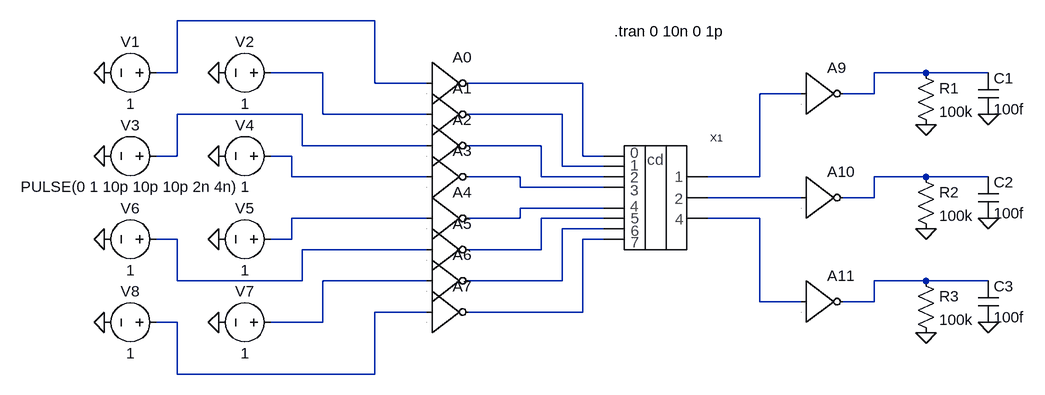
[diagram p0: schematic example_shifrator.asc]
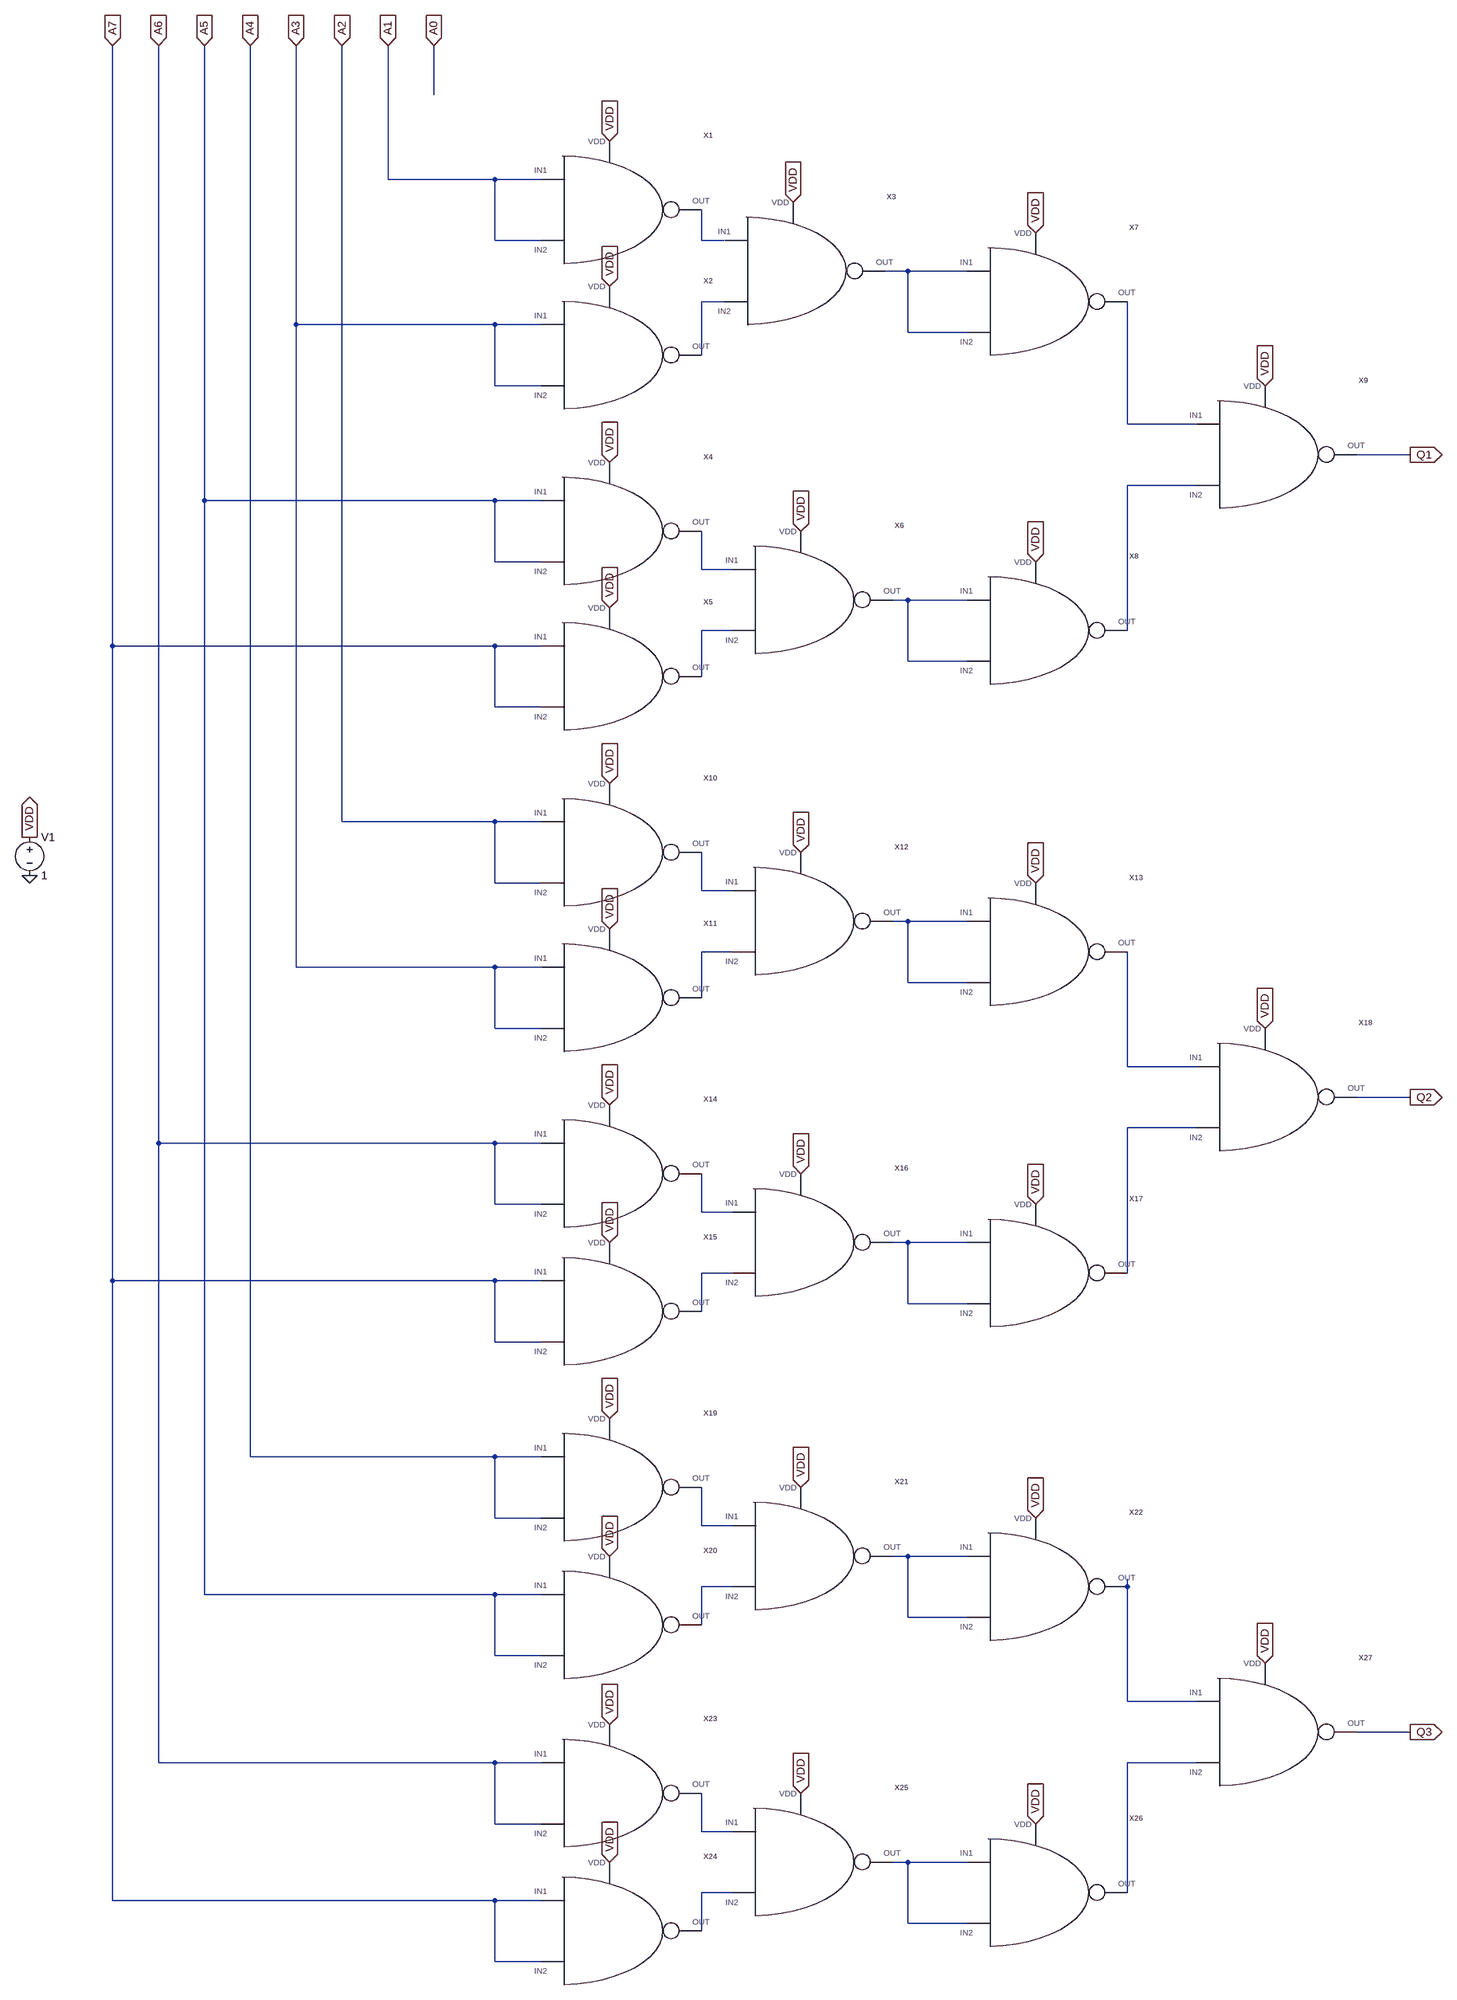
[diagram p1: sub-circuit shifrator.asc]
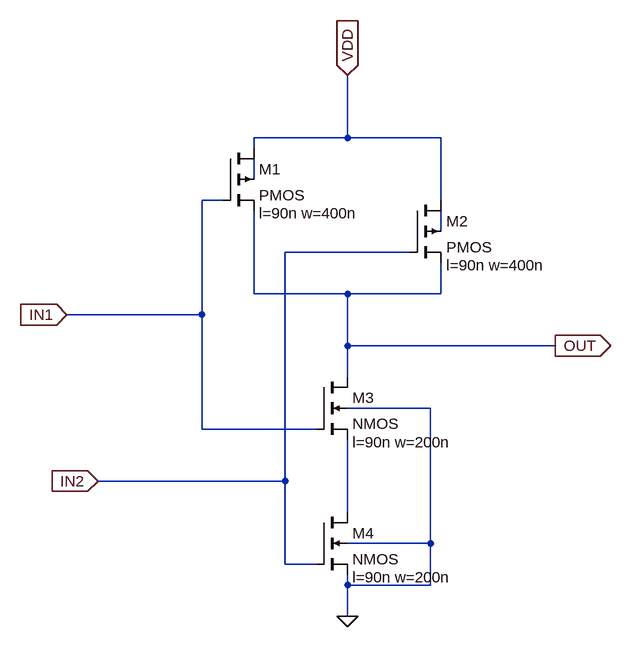
[diagram p2: sub-circuit nand.asc]
example_shifrator.asc, the LTspice schematic file:
Version 4
SHEET 1 1116 912
WIRE -192 -112 -496 -112
WIRE -496 -32 -496 -112
WIRE -496 -32 -528 -32
WIRE -272 -32 -352 -32
WIRE 656 -32 576 -32
WIRE 752 -32 656 -32
WIRE -192 -16 -192 -112
WIRE -112 -16 -192 -16
WIRE 128 -16 -48 -16
WIRE 464 0 400 0
WIRE 576 0 576 -32
WIRE 576 0 528 0
WIRE -304 32 -496 32
WIRE -272 32 -272 -32
WIRE -112 32 -272 32
WIRE 96 32 -48 32
WIRE -304 80 -304 32
WIRE -112 80 -304 80
WIRE 64 80 -48 80
WIRE -496 96 -496 32
WIRE -496 96 -528 96
WIRE -320 96 -352 96
WIRE 128 96 128 -16
WIRE 160 96 128 96
WIRE 96 112 96 32
WIRE 160 112 96 112
WIRE -320 128 -320 96
WIRE -112 128 -320 128
WIRE 32 128 -48 128
WIRE 64 128 64 80
WIRE 160 128 64 128
WIRE 400 128 400 0
WIRE 400 128 320 128
WIRE 656 128 576 128
WIRE 752 128 656 128
WIRE 32 144 32 128
WIRE 160 144 32 144
WIRE 464 160 320 160
WIRE 576 160 576 128
WIRE 576 160 528 160
WIRE 160 176 32 176
WIRE -112 192 -320 192
WIRE 32 192 32 176
WIRE 32 192 -48 192
WIRE 160 192 64 192
WIRE 400 192 320 192
WIRE 160 208 96 208
WIRE -496 224 -528 224
WIRE -320 224 -320 192
WIRE -320 224 -352 224
WIRE 160 224 128 224
WIRE -112 240 -304 240
WIRE 64 240 64 192
WIRE 64 240 -48 240
WIRE -496 288 -496 224
WIRE -304 288 -304 240
WIRE -304 288 -496 288
WIRE -112 288 -272 288
WIRE 96 288 96 208
WIRE 96 288 -48 288
WIRE 656 288 576 288
WIRE 752 288 656 288
WIRE 400 320 400 192
WIRE 464 320 400 320
WIRE 576 320 576 288
WIRE 576 320 528 320
WIRE -112 336 -192 336
WIRE 128 336 128 224
WIRE 128 336 -48 336
WIRE -496 352 -528 352
WIRE -272 352 -272 288
WIRE -272 352 -352 352
WIRE -496 432 -496 352
WIRE -192 432 -192 336
WIRE -192 432 -496 432
FLAG 656 48 0
FLAG 752 32 0
FLAG 656 208 0
FLAG 752 192 0
FLAG 656 368 0
FLAG 752 352 0
FLAG -608 -32 0
FLAG -432 -32 0
FLAG -608 96 0
FLAG -432 96 0
FLAG -432 224 0
FLAG -608 224 0
FLAG -432 352 0
FLAG -608 352 0
SYMBOL Digital\\inv -112 -80 R0
SYMATTR InstName A0
SYMBOL Digital\\inv -112 -32 R0
SYMATTR InstName A1
SYMBOL Digital\\inv -112 16 R0
SYMATTR InstName A2
SYMBOL Digital\\inv -112 64 R0
SYMATTR InstName A3
SYMBOL Digital\\inv -112 128 R0
SYMATTR InstName A4
SYMBOL Digital\\inv -112 176 R0
SYMATTR InstName A5
SYMBOL Digital\\inv -112 224 R0
SYMATTR InstName A6
SYMBOL Digital\\inv -112 272 R0
SYMATTR InstName A7
SYMBOL Digital\\inv 464 -64 R0
SYMATTR InstName A9
SYMBOL Digital\\inv 464 96 R0
SYMATTR InstName A10
SYMBOL Digital\\inv 464 256 R0
SYMATTR InstName A11
SYMBOL res 640 -48 R0
SYMATTR InstName R1
SYMATTR Value 100k
SYMBOL res 640 112 R0
SYMATTR InstName R2
SYMATTR Value 100k
SYMBOL res 640 272 R0
SYMATTR InstName R3
SYMATTR Value 100k
SYMBOL cap 736 -32 R0
SYMATTR InstName C1
SYMATTR Value 100f
SYMBOL cap 736 128 R0
SYMATTR InstName C2
SYMATTR Value 100f
SYMBOL cap 736 288 R0
SYMATTR InstName C3
SYMATTR Value 100f
SYMBOL voltage -512 -32 R90
WINDOW 0 -32 56 VBottom 2
WINDOW 3 32 56 VTop 2
WINDOW 123 0 0 Left 2
WINDOW 39 0 0 Left 2
SYMATTR InstName V1
SYMATTR Value 1
SYMBOL voltage -336 -32 R90
WINDOW 0 -32 56 VBottom 2
WINDOW 3 32 56 VTop 2
WINDOW 123 0 0 Left 2
WINDOW 39 0 0 Left 2
SYMATTR InstName V2
SYMATTR Value 1
SYMBOL voltage -512 96 R90
WINDOW 0 -32 56 VBottom 2
WINDOW 3 32 56 VTop 2
WINDOW 123 0 0 Left 2
WINDOW 39 0 0 Left 2
SYMATTR InstName V3
SYMATTR Value PULSE(0 1 10p 10p 10p 2n 4n)
SYMBOL voltage -336 96 R90
WINDOW 0 -32 56 VBottom 2
WINDOW 3 32 56 VTop 2
WINDOW 123 0 0 Left 2
WINDOW 39 0 0 Left 2
SYMATTR InstName V4
SYMATTR Value 1
SYMBOL voltage -336 224 R90
WINDOW 0 -32 56 VBottom 2
WINDOW 3 32 56 VTop 2
WINDOW 123 0 0 Left 2
WINDOW 39 0 0 Left 2
SYMATTR InstName V5
SYMATTR Value 1
SYMBOL voltage -512 224 R90
WINDOW 0 -32 56 VBottom 2
WINDOW 3 32 56 VTop 2
WINDOW 123 0 0 Left 2
WINDOW 39 0 0 Left 2
SYMATTR InstName V6
SYMATTR Value 1
SYMBOL voltage -336 352 R90
WINDOW 0 -32 56 VBottom 2
WINDOW 3 32 56 VTop 2
WINDOW 123 0 0 Left 2
WINDOW 39 0 0 Left 2
SYMATTR InstName V7
SYMATTR Value 1
SYMBOL voltage -512 352 R90
WINDOW 0 -32 56 VBottom 2
WINDOW 3 32 56 VTop 2
WINDOW 123 0 0 Left 2
WINDOW 39 0 0 Left 2
SYMATTR InstName V8
SYMATTR Value 1
SYMBOL shifrator 240 160 R0
SYMATTR InstName X1
TEXT 176 -96 Left 2 !.tran 0 10n 0 1p

shifrator.asc, the sub-circuit schematic file:
Version 4
SHEET 1 1628 3896
WIRE -512 -112 -512 -256
WIRE -608 64 -608 -256
WIRE -384 64 -608 64
WIRE -288 64 -384 64
WIRE -384 192 -384 64
WIRE -288 192 -384 192
WIRE 48 192 48 128
WIRE 96 192 48 192
WIRE 480 256 432 256
WIRE 608 256 480 256
WIRE 96 320 48 320
WIRE -800 368 -800 -256
WIRE -384 368 -800 368
WIRE -288 368 -384 368
WIRE 480 384 480 256
WIRE 608 384 480 384
WIRE 48 432 48 320
WIRE -384 496 -384 368
WIRE -288 496 -384 496
WIRE 944 576 944 320
WIRE 1088 576 944 576
WIRE 1536 640 1424 640
WIRE 1088 704 944 704
WIRE -992 736 -992 -256
WIRE -384 736 -992 736
WIRE -288 736 -384 736
WIRE -384 864 -384 736
WIRE -288 864 -384 864
WIRE 48 880 48 800
WIRE 112 880 48 880
WIRE 480 944 448 944
WIRE 608 944 480 944
WIRE 112 1008 48 1008
WIRE 944 1008 944 704
WIRE -1184 1040 -1184 -256
WIRE -384 1040 -1184 1040
WIRE -288 1040 -384 1040
WIRE 480 1072 480 944
WIRE 608 1072 480 1072
WIRE 48 1104 48 1008
WIRE -384 1168 -384 1040
WIRE -288 1168 -384 1168
WIRE -704 1408 -704 -256
WIRE -384 1408 -704 1408
WIRE -288 1408 -384 1408
WIRE -384 1536 -384 1408
WIRE -288 1536 -384 1536
WIRE 48 1552 48 1472
WIRE 112 1552 48 1552
WIRE 480 1616 448 1616
WIRE 608 1616 480 1616
WIRE 112 1680 48 1680
WIRE -800 1712 -800 368
WIRE -384 1712 -800 1712
WIRE -288 1712 -384 1712
WIRE 480 1744 480 1616
WIRE 608 1744 480 1744
WIRE 48 1776 48 1680
WIRE -384 1840 -384 1712
WIRE -288 1840 -384 1840
WIRE 944 1920 944 1680
WIRE 1088 1920 944 1920
WIRE 1536 1984 1424 1984
WIRE 1088 2048 944 2048
WIRE -1088 2080 -1088 -256
WIRE -384 2080 -1088 2080
WIRE -288 2080 -384 2080
WIRE -384 2208 -384 2080
WIRE -288 2208 -384 2208
WIRE 48 2224 48 2144
WIRE 112 2224 48 2224
WIRE 480 2288 448 2288
WIRE 608 2288 480 2288
WIRE 112 2352 48 2352
WIRE 944 2352 944 2048
WIRE -1184 2368 -1184 1040
WIRE -384 2368 -1184 2368
WIRE -288 2368 -384 2368
WIRE 480 2416 480 2288
WIRE 608 2416 480 2416
WIRE 48 2432 48 2352
WIRE -384 2496 -384 2368
WIRE -288 2496 -384 2496
WIRE -896 2736 -896 -256
WIRE -384 2736 -896 2736
WIRE -288 2736 -384 2736
WIRE -384 2864 -384 2736
WIRE -288 2864 -384 2864
WIRE 48 2880 48 2800
WIRE 112 2880 48 2880
WIRE 480 2944 448 2944
WIRE 608 2944 480 2944
WIRE 112 3008 48 3008
WIRE 944 3008 944 2992
WIRE -992 3024 -992 736
WIRE -384 3024 -992 3024
WIRE -288 3024 -384 3024
WIRE 480 3072 480 2944
WIRE 608 3072 480 3072
WIRE 48 3088 48 3008
WIRE -384 3152 -384 3024
WIRE -288 3152 -384 3152
WIRE 944 3248 944 3008
WIRE 1088 3248 944 3248
WIRE 1536 3312 1424 3312
WIRE -1088 3376 -1088 2080
WIRE -384 3376 -1088 3376
WIRE -288 3376 -384 3376
WIRE 1088 3376 944 3376
WIRE -384 3504 -384 3376
WIRE -288 3504 -384 3504
WIRE 48 3520 48 3440
WIRE 112 3520 48 3520
WIRE 480 3584 448 3584
WIRE 608 3584 480 3584
WIRE 112 3648 48 3648
WIRE 944 3648 944 3376
WIRE -1184 3664 -1184 2368
WIRE -384 3664 -1184 3664
WIRE -288 3664 -384 3664
WIRE 480 3712 480 3584
WIRE 608 3712 480 3712
WIRE 48 3728 48 3648
WIRE -384 3792 -384 3664
WIRE -288 3792 -384 3792
FLAG -1184 -256 A7
IOPIN -1184 -256 In
FLAG -1088 -256 A6
IOPIN -1088 -256 In
FLAG -992 -256 A5
IOPIN -992 -256 In
FLAG -896 -256 A4
IOPIN -896 -256 In
FLAG -800 -256 A3
IOPIN -800 -256 In
FLAG -704 -256 A2
IOPIN -704 -256 In
FLAG -608 -256 A1
IOPIN -608 -256 In
FLAG -512 -256 A0
IOPIN -512 -256 In
FLAG 1536 640 Q1
IOPIN 1536 640 Out
FLAG 1536 1984 Q2
IOPIN 1536 1984 Out
FLAG 1536 3312 Q3
IOPIN 1536 3312 Out
FLAG -1776 1440 VDD
IOPIN -1776 1440 Out
FLAG -1776 1520 0
FLAG -144 1328 VDD
IOPIN -144 1328 In
FLAG -144 1632 VDD
IOPIN -144 1632 In
FLAG 256 1472 VDD
IOPIN 256 1472 In
FLAG -144 960 VDD
IOPIN -144 960 In
FLAG -144 -16 VDD
IOPIN -144 -16 In
FLAG 240 112 VDD
IOPIN 240 112 In
FLAG 752 176 VDD
IOPIN 752 176 In
FLAG -144 288 VDD
IOPIN -144 288 In
FLAG 1232 496 VDD
IOPIN 1232 496 In
FLAG -144 656 VDD
IOPIN -144 656 In
FLAG 256 800 VDD
IOPIN 256 800 In
FLAG 752 864 VDD
IOPIN 752 864 In
FLAG 752 1536 VDD
IOPIN 752 1536 In
FLAG 1232 1840 VDD
IOPIN 1232 1840 In
FLAG -144 2000 VDD
IOPIN -144 2000 In
FLAG 256 2144 VDD
IOPIN 256 2144 In
FLAG 752 2208 VDD
IOPIN 752 2208 In
FLAG -144 2288 VDD
IOPIN -144 2288 In
FLAG -144 2656 VDD
IOPIN -144 2656 In
FLAG 256 2800 VDD
IOPIN 256 2800 In
FLAG 752 2864 VDD
IOPIN 752 2864 In
FLAG -144 2944 VDD
IOPIN -144 2944 In
FLAG 1232 3168 VDD
IOPIN 1232 3168 In
FLAG -144 3296 VDD
IOPIN -144 3296 In
FLAG 256 3440 VDD
IOPIN 256 3440 In
FLAG 752 3504 VDD
IOPIN 752 3504 In
FLAG -144 3584 VDD
IOPIN -144 3584 In
SYMBOL nand -240 128 R0
SYMATTR InstName X1
SYMBOL nand -240 432 R0
SYMATTR InstName X2
SYMBOL nand 144 256 R0
SYMATTR InstName X3
SYMBOL nand -240 800 R0
SYMATTR InstName X4
SYMBOL nand -240 1104 R0
SYMATTR InstName X5
SYMBOL nand 160 944 R0
SYMATTR InstName X6
SYMBOL nand 656 320 R0
SYMATTR InstName X7
SYMBOL nand 656 1008 R0
SYMATTR InstName X8
SYMBOL nand 1136 640 R0
SYMATTR InstName X9
SYMBOL nand -240 1472 R0
SYMATTR InstName X10
SYMBOL nand -240 1776 R0
SYMATTR InstName X11
SYMBOL nand 160 1616 R0
SYMATTR InstName X12
SYMBOL nand 656 1680 R0
SYMATTR InstName X13
SYMBOL nand -240 2144 R0
SYMATTR InstName X14
SYMBOL nand -240 2432 R0
SYMATTR InstName X15
SYMBOL nand 160 2288 R0
SYMATTR InstName X16
SYMBOL nand 656 2352 R0
SYMATTR InstName X17
SYMBOL nand 1136 1984 R0
SYMATTR InstName X18
SYMBOL nand -240 2800 R0
SYMATTR InstName X19
SYMBOL nand -240 3088 R0
SYMATTR InstName X20
SYMBOL nand 160 2944 R0
SYMATTR InstName X21
SYMBOL nand 656 3008 R0
SYMATTR InstName X22
SYMBOL nand -240 3440 R0
SYMATTR InstName X23
SYMBOL nand -240 3728 R0
SYMATTR InstName X24
SYMBOL nand 160 3584 R0
SYMATTR InstName X25
SYMBOL nand 656 3648 R0
SYMATTR InstName X26
SYMBOL nand 1136 3312 R0
SYMATTR InstName X27
SYMBOL voltage -1776 1424 R0
WINDOW 123 0 0 Left 0
WINDOW 39 0 0 Left 0
SYMATTR InstName V1
SYMATTR Value 1

nand.asc, the sub-circuit schematic file:
Version 4
SHEET 1 1232 788
WIRE 448 -192 448 -288
WIRE 448 -192 304 -192
WIRE 592 -192 448 -192
WIRE 304 -176 304 -192
WIRE 304 -128 304 -160
WIRE 256 -96 224 -96
WIRE 592 -96 592 -192
WIRE 592 -48 592 -80
WIRE 544 -16 352 -16
WIRE 304 48 304 -80
WIRE 448 48 304 48
WIRE 592 48 592 0
WIRE 592 48 448 48
WIRE 224 80 224 -96
WIRE 224 80 16 80
WIRE 448 128 448 48
WIRE 768 128 448 128
WIRE 448 176 448 128
WIRE 576 224 448 224
WIRE 224 256 224 80
WIRE 400 256 224 256
WIRE 352 336 352 -16
WIRE 352 336 64 336
WIRE 448 384 448 272
WIRE 576 432 576 224
WIRE 576 432 448 432
WIRE 352 464 352 336
WIRE 400 464 352 464
WIRE 448 496 448 480
WIRE 576 496 576 432
WIRE 576 496 448 496
WIRE 448 544 448 496
FLAG 448 544 0
FLAG 768 128 OUT
IOPIN 768 128 Out
FLAG 448 -288 VDD
IOPIN 448 -288 In
FLAG 16 80 IN1
IOPIN 16 80 In
FLAG 64 336 IN2
IOPIN 64 336 In
SYMBOL pmos4 256 -176 R0
WINDOW 123 56 100 Left 2
SYMATTR Value2 l=90n w=400n
SYMATTR InstName M1
SYMBOL pmos4 544 -96 R0
WINDOW 123 56 100 Left 2
SYMATTR Value2 l=90n w=400n
SYMATTR InstName M2
SYMBOL nmos4 400 176 R0
WINDOW 123 56 100 Left 2
SYMATTR Value2 l=90n w=200n
SYMATTR InstName M3
SYMBOL nmos4 400 384 R0
WINDOW 123 56 100 Left 2
SYMATTR Value2 l=90n w=200n
SYMATTR InstName M4

The netlist it stands for:
* example_shifrator.asc
A0 N001 0 0 0 0 N004 0 0 BUF
A1 N002 0 0 0 0 N007 0 0 BUF
A2 N006 0 0 0 0 N008 0 0 BUF
A3 N009 0 0 0 0 N010 0 0 BUF
A4 N014 0 0 0 0 N013 0 0 BUF
A5 N018 0 0 0 0 N015 0 0 BUF
A6 N020 0 0 0 0 N017 0 0 BUF
A7 N022 0 0 0 0 N019 0 0 BUF
A9 N005 0 0 0 0 N003 0 0 BUF
A10 N012 0 0 0 0 N011 0 0 BUF
A11 N016 0 0 0 0 N021 0 0 BUF
R1 N003 0 100k
R2 N011 0 100k
R3 N021 0 100k
C1 N003 0 100f
C2 N011 0 100f
C3 N021 0 100f
V1 N001 0 1
V2 N002 0 1
V3 N006 0 PULSE(0 1 10p 10p 10p 2n 4n)
V4 N009 0 1
V5 N014 0 1
V6 N018 0 1
V7 N020 0 1
V8 N022 0 1
XX1 N004 N007 N008 N010 N013 N015 N017 N019 N005 N012 N016 shifrator

* block symbol definitions
.subckt shifrator A0 A1 A2 A3 A4 A5 A6 A7 Q1 Q2 Q3
XX1 A1 A1 VDD N001 nand
XX2 A3 A3 VDD N003 nand
XX3 N001 N003 VDD N002 nand
XX4 A5 A5 VDD N006 nand
XX5 A7 A7 VDD N008 nand
XX6 N006 N008 VDD N007 nand
XX7 N002 N002 VDD N004 nand
XX8 N007 N007 VDD N005 nand
XX9 N004 N005 VDD Q1 nand
XX10 A2 A2 VDD N009 nand
XX11 A3 A3 VDD N011 nand
XX12 N009 N011 VDD N010 nand
XX13 N010 N010 VDD N012 nand
XX14 A6 A6 VDD N014 nand
XX15 A7 A7 VDD N016 nand
XX16 N014 N016 VDD N015 nand
XX17 N015 N015 VDD N013 nand
XX18 N012 N013 VDD Q2 nand
XX19 A4 A4 VDD N017 nand
XX20 A5 A5 VDD N019 nand
XX21 N017 N019 VDD N018 nand
XX22 N018 N018 VDD N020 nand
XX23 A6 A6 VDD N022 nand
XX24 A7 A7 VDD N024 nand
XX25 N022 N024 VDD N023 nand
XX26 N023 N023 VDD N021 nand
XX27 N020 N021 VDD Q3 nand
V1 VDD 0 1
.ends shifrator

.subckt nand IN1 IN2 VDD OUT
M1 VDD IN1 OUT N001 PMOS l=90n w=400n
M2 VDD IN2 OUT N002 PMOS l=90n w=400n
M3 OUT IN1 N003 0 NMOS l=90n w=200n
M4 N003 IN2 0 0 NMOS l=90n w=200n
.ends nand

.model NMOS NMOS
.model PMOS PMOS
.lib standard.mos
.tran 0 10n 0 1p
.backanno
.end